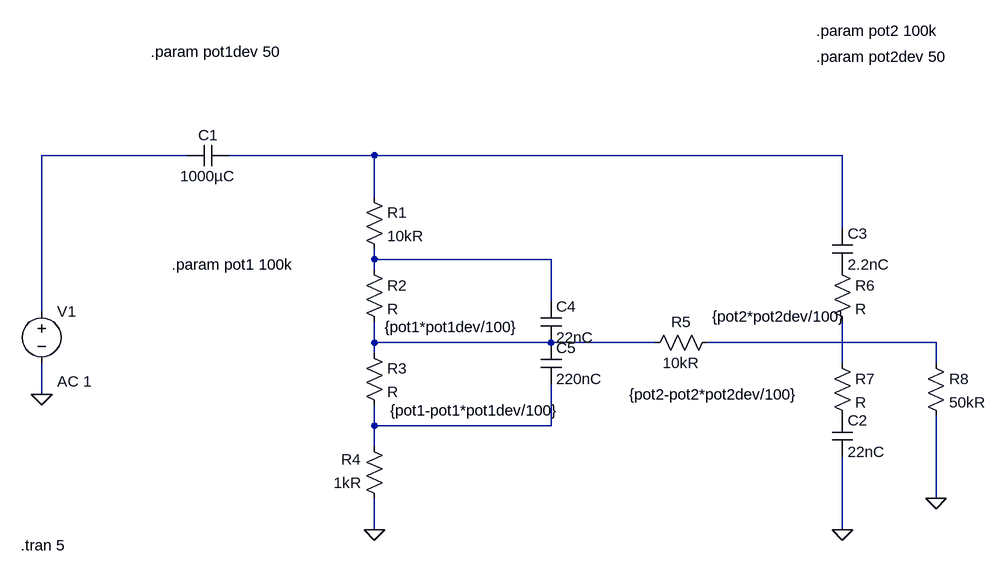
[diagram p0: schematic Draft6.asc]
Draft6.asc, the LTspice schematic file:
Version 4.1
SHEET 1 880 728
WIRE -1296 112 -1520 112
WIRE -1008 112 -1232 112
WIRE -288 112 -1008 112
WIRE -1008 176 -1008 112
WIRE -288 224 -288 112
WIRE -1008 272 -1008 256
WIRE -736 272 -1008 272
WIRE -1008 288 -1008 272
WIRE -736 336 -736 272
WIRE -1520 352 -1520 112
WIRE -1008 400 -1008 368
WIRE -736 400 -1008 400
WIRE -576 400 -736 400
WIRE -144 400 -496 400
WIRE -1008 416 -1008 400
WIRE -288 432 -288 368
WIRE -144 432 -144 400
WIRE -1520 480 -1520 432
WIRE -1008 528 -1008 496
WIRE -736 528 -736 464
WIRE -736 528 -1008 528
WIRE -1008 560 -1008 528
WIRE -144 640 -144 512
WIRE -1008 688 -1008 640
WIRE -288 688 -288 576
FLAG -1520 480 0
FLAG -1008 688 0
FLAG -288 688 0
FLAG -144 640 0
SYMBOL voltage -1520 336 R0
WINDOW 123 24 124 Left 2
WINDOW 39 0 0 Left 0
SYMATTR InstName V1
SYMATTR Value ""
SYMATTR Value2 AC 1
SYMBOL cap -1232 96 R90
WINDOW 0 0 32 VBottom 2
WINDOW 3 32 32 VTop 2
SYMATTR InstName C1
SYMATTR Value 1000µC
SYMBOL res -1024 160 R0
SYMATTR InstName R1
SYMATTR Value 10kR
SYMBOL res -1024 272 R0
SYMATTR InstName R2
SYMBOL res -1024 400 R0
SYMATTR InstName R3
SYMBOL res -992 656 R180
WINDOW 0 36 76 Left 2
WINDOW 3 36 40 Left 2
SYMATTR InstName R4
SYMATTR Value 1kR
SYMBOL res -592 416 R270
WINDOW 0 32 56 VTop 2
WINDOW 3 0 56 VBottom 2
SYMATTR InstName R5
SYMATTR Value 10kR
SYMBOL res -304 272 R0
SYMATTR InstName R6
SYMBOL res -304 416 R0
SYMATTR InstName R7
SYMBOL res -160 416 R0
SYMATTR InstName R8
SYMATTR Value 50kR
SYMBOL cap -304 512 R0
SYMATTR InstName C2
SYMATTR Value 22nC
SYMBOL cap -304 224 R0
SYMATTR InstName C3
SYMATTR Value 2.2nC
SYMBOL cap -752 336 R0
SYMATTR InstName C4
SYMATTR Value 22nC
SYMBOL cap -752 400 R0
SYMATTR InstName C5
SYMATTR Value 220nC
TEXT -1320 280 Left 2 !.param pot1 100k
TEXT -328 -80 Left 2 !.param pot2 100k
TEXT -1352 -48 Left 2 !.param pot1dev 50
TEXT -992 376 Left 2 !{pot1*pot1dev/100}
TEXT -984 504 Left 2 !{pot1-pot1*pot1dev/100}
TEXT -488 360 Left 2 !{pot2*pot2dev/100}
TEXT -616 480 Left 2 !{pot2-pot2*pot2dev/100}
TEXT -328 -40 Left 2 !.param pot2dev 50
TEXT -1552 712 Left 2 !.tran 5

The netlist it stands for:
* Draft6.asc
V1 N001 0 AC 1
C1 N002 N001 1000µC
R1 N002 N003 10kR
R2 N003 N004 R
R3 N004 N007 R
R4 0 N007 1kR
R5 N004 N005 10kR
R6 P001 N006 R
R7 N006 P002 R
R8 N005 0 50kR
C2 P002 0 22nC
C3 N002 P001 2.2nC
C4 N003 N004 22nC
C5 N004 N007 220nC
.param pot1 100k
.param pot2 100k
.param pot1dev 50
{pot1*pot1dev/100}
{pot1-pot1*pot1dev/100}
{pot2*pot2dev/100}
{pot2-pot2*pot2dev/100}
.param pot2dev 50
.tran 5
.backanno
.end